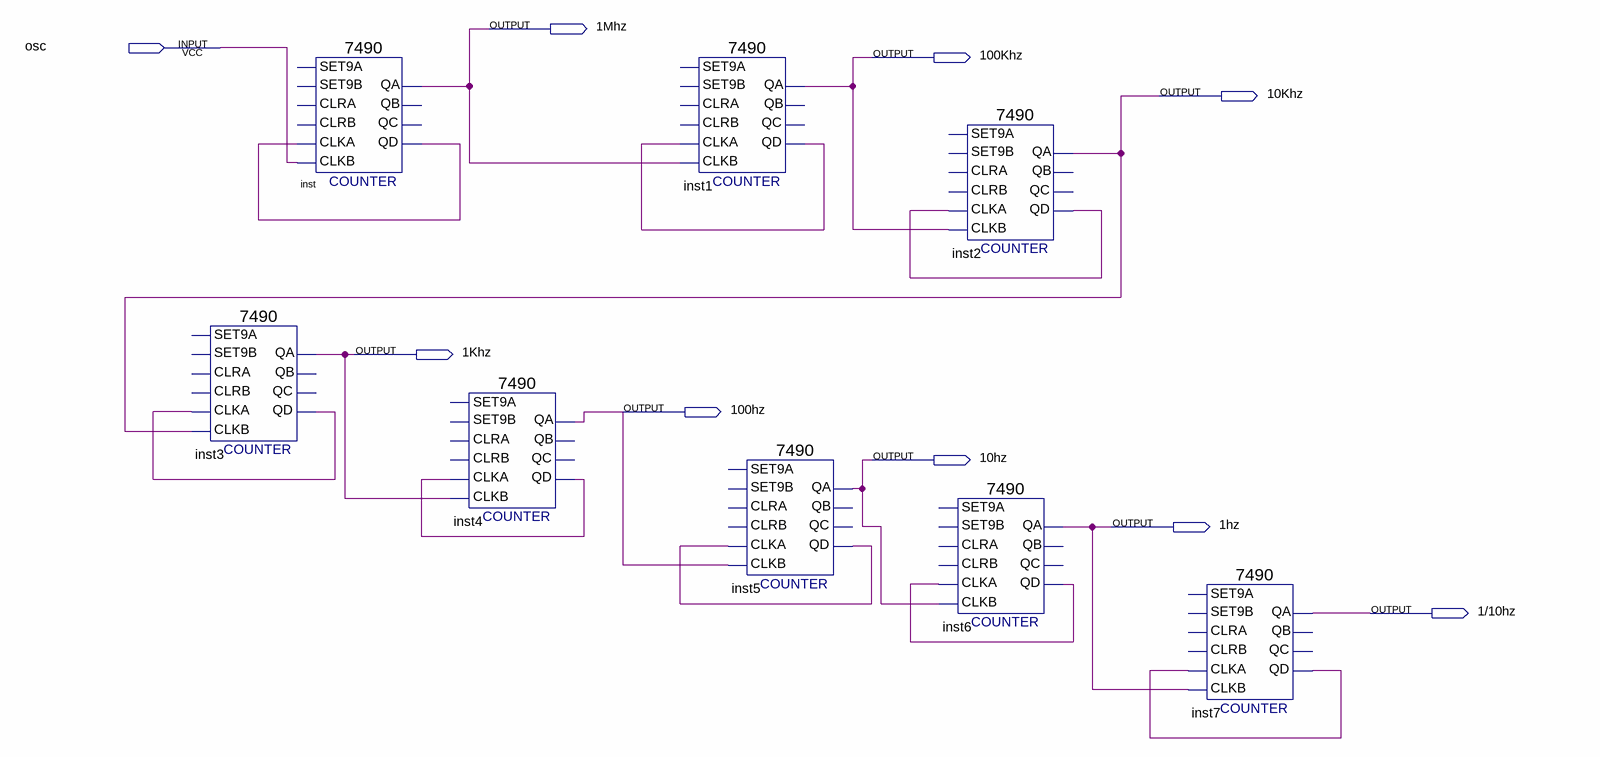
[diagram p0: schematic sheet]
// Quartus schematic div8.bdf as structural Verilog: 8 symbols, 9 pins
module div8 (
  input  osc,
  output \1Mhz ,
  output \100Khz ,
  output \10Khz ,
  output \1Khz ,
  output \100hz ,
  output \10hz ,
  output \1hz ,
  output \1/10hz 
);

  wire inst1_qd, inst2_qd, inst3_qd, inst4_qd, inst5_qd, inst6_qd, inst7_qd, inst_qd;

  \7490  inst3 (.CLKB(\10Khz ), .CLKA(inst3_qd), .QD(inst3_qd), .QA(\1Khz ));  // open: SET9A, CLRA, SET9B, CLRB, QB, QC
  \7490  inst (.CLKB(osc), .CLKA(inst_qd), .QD(inst_qd), .QA(\1Mhz ));  // open: SET9A, CLRA, SET9B, CLRB, QB, QC
  \7490  inst4 (.CLKB(\1Khz ), .CLKA(inst4_qd), .QD(inst4_qd), .QA(\100hz ));  // open: SET9A, CLRA, SET9B, CLRB, QB, QC
  \7490  inst1 (
    .CLKB(\1Mhz ), .CLKA(inst1_qd), .QD(inst1_qd), .QA(\100Khz ));  // open: SET9A, CLRA, SET9B, CLRB, QB, QC
  \7490  inst5 (.CLKB(\100hz ), .CLKA(inst5_qd), .QD(inst5_qd), .QA(\10hz ));  // open: SET9A, CLRA, SET9B, CLRB, QB, QC
  \7490  inst2 (
    .CLKB(\100Khz ), .CLKA(inst2_qd), .QD(inst2_qd), .QA(\10Khz ));  // open: SET9A, CLRA, SET9B, CLRB, QB, QC
  \7490  inst6 (.CLKB(\10hz ), .CLKA(inst6_qd), .QD(inst6_qd), .QA(\1hz ));  // open: SET9A, CLRA, SET9B, CLRB, QB, QC
  \7490  inst7 (.CLKB(\1hz ), .CLKA(inst7_qd), .QD(inst7_qd), .QA(\1/10hz ));  // open: SET9A, CLRA, SET9B, CLRB, QB, QC
endmodule
